# Altium schematic sheet 声音传感器.SchDoc
size A4
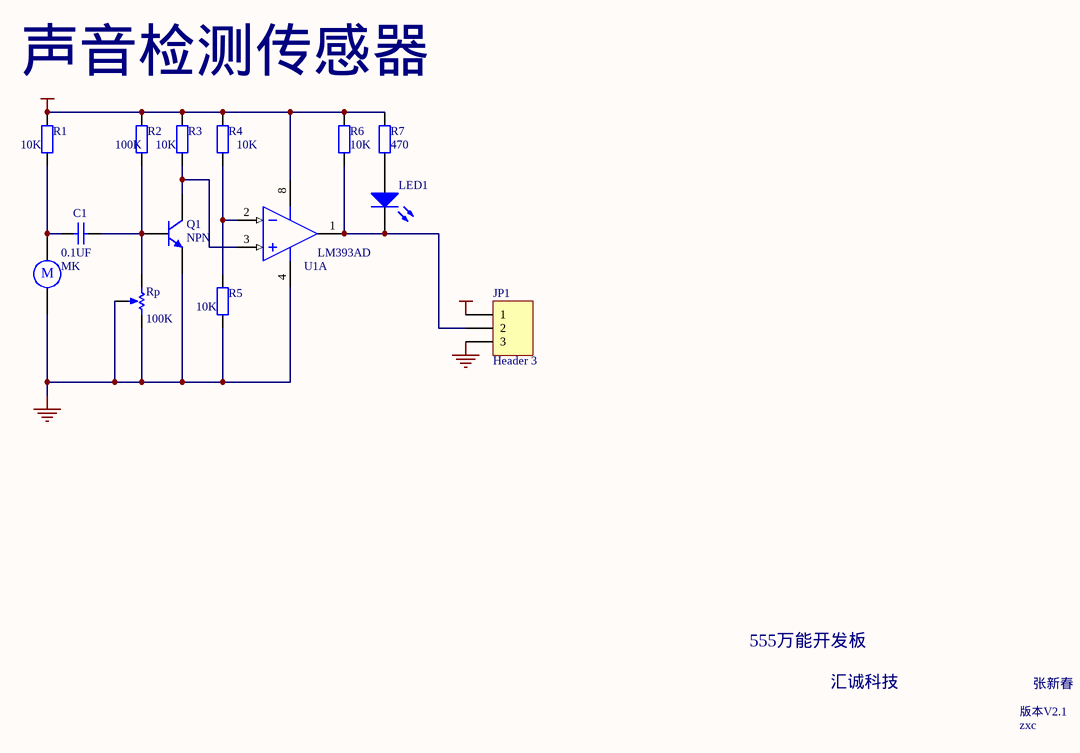
[diagram p0: 声音传感器.SchDoc]

## Parts
C1  value 0.1UF  [C1608-0603]
JP1  Header 3  [HDR1X3]
LED1  (no value)  [HDR1X2]
MK  (no value)  [MK]
Q1  NPN  [SO-G3]
R1  value 10K  [C1608-0603]
R2  value 100K  [C1608-0603]
R3  value 10K  [C1608-0603]
R4  value 10K  [C1608-0603]
R5  value 10K  [C1608-0603]
R6  value 10K  [C1608-0603]
R7  value 470  [C1608-0603]
Rp  value 100K  [SIP3-D]
U1  LM393AD  [CDFP-8]  (part A of 2)

## Nets
GND: JP1.3 MK.2 Q1.2(E) R5.1 Rp.2(BOT) Rp.3(TAP) U1.4(V-)
VCC: JP1.1 R1.2 R2.2 R3.2 R4.2 R6.1 R7.1 U1.8(V+)
NetC1_1: C1.1 MK.1 R1.1
NetC1_2: C1.2 Q1.1(B) R2.1 Rp.1(TOP)
NetJP1_2: JP1.2 LED1.2(K) R6.2 U1.1(OUT)
NetLED1_1: LED1.1(A) R7.2
NetQ1_3: Q1.3(C) R3.1 U1.3(IN+)
NetR4_1: R4.1 R5.2 U1.2(IN-)

## Notes on the sheet
- 声音检测传感器
- 555万能开发板
- 汇诚科技
- 版本V2.1
- 张新春
- zxc
- (in symbol Motor) M

## Library data of the parts
C1 = Cap Semi: Capacitor (Semiconductor SIM Model); Published: 8-Jun-2000; LatestRevisionDate: 17-Jul-2002; LatestRevisionNote: Re-released for DXP Platform.; PackageReference: C1206; Publisher: Altium Limited
JP1 = Header 3: Header, 3-Pin; LatestRevisionDate: 17-Jul-2002; LatestRevisionNote: Re-released for DXP Platform.; Publisher: Altium Limited
LED1 = LED3: Typical BLUE SiC LED; Published: 8-Jun-2000; LatestRevisionDate: 17-Dec-2003; LatestRevisionNote: PCB Footprint replaced.; Publisher: Altium Limited
MK = Motor: Motor, General Kind; Published: 24-Mar-1999; LatestRevisionDate: 17-Jul-2002; LatestRevisionNote: Re-released for DXP Platform.; Publisher: Altium Limited
Q1 = NPN: NPN Bipolar Transistor; Published: 8-Jun-2000; LatestRevisionDate: 17-Jul-2002; LatestRevisionNote: Re-released for DXP Platform.; Publisher: Altium Limited; Code_JEDEC: TO-226-AA
R1-R7 = Res2: Resistor; Published: 8-Jun-2000; LatestRevisionDate: 17-Jul-2002; LatestRevisionNote: Re-released for DXP Platform.; Publisher: Altium Limited
Rp = RPot: Potentiometer; Sim Note: Enter the Resistance value and the set point into parameter fields.; Set Position: 0.5; Published: 8-Jun-2000; LatestRevisionDate: 17-Jul-2002; LatestRevisionNote: Re-released for DXP Platform.; Publisher: Altium Limited
U1 = LM393AD: Low-Power Dual Voltage Comparator; Published: 24-Aug-2001; LatestRevisionDate: 6-Jun-2005; LatestRevisionNote: Stylized 3D Model Added.; DatasheetDocument: Nov-1992; PackageDocument: Jul-1998; PackageReference: SO8; Publisher: Altium Limited; Code_JEDEC: MS-012-AA; Code_IPC: SO8; ComponentLink1Description: Manufacturer Link; ComponentLink1URL: http://www.st.com/